# EAGLE schematic L6205_2XDC (EAGLE 9.3.1)
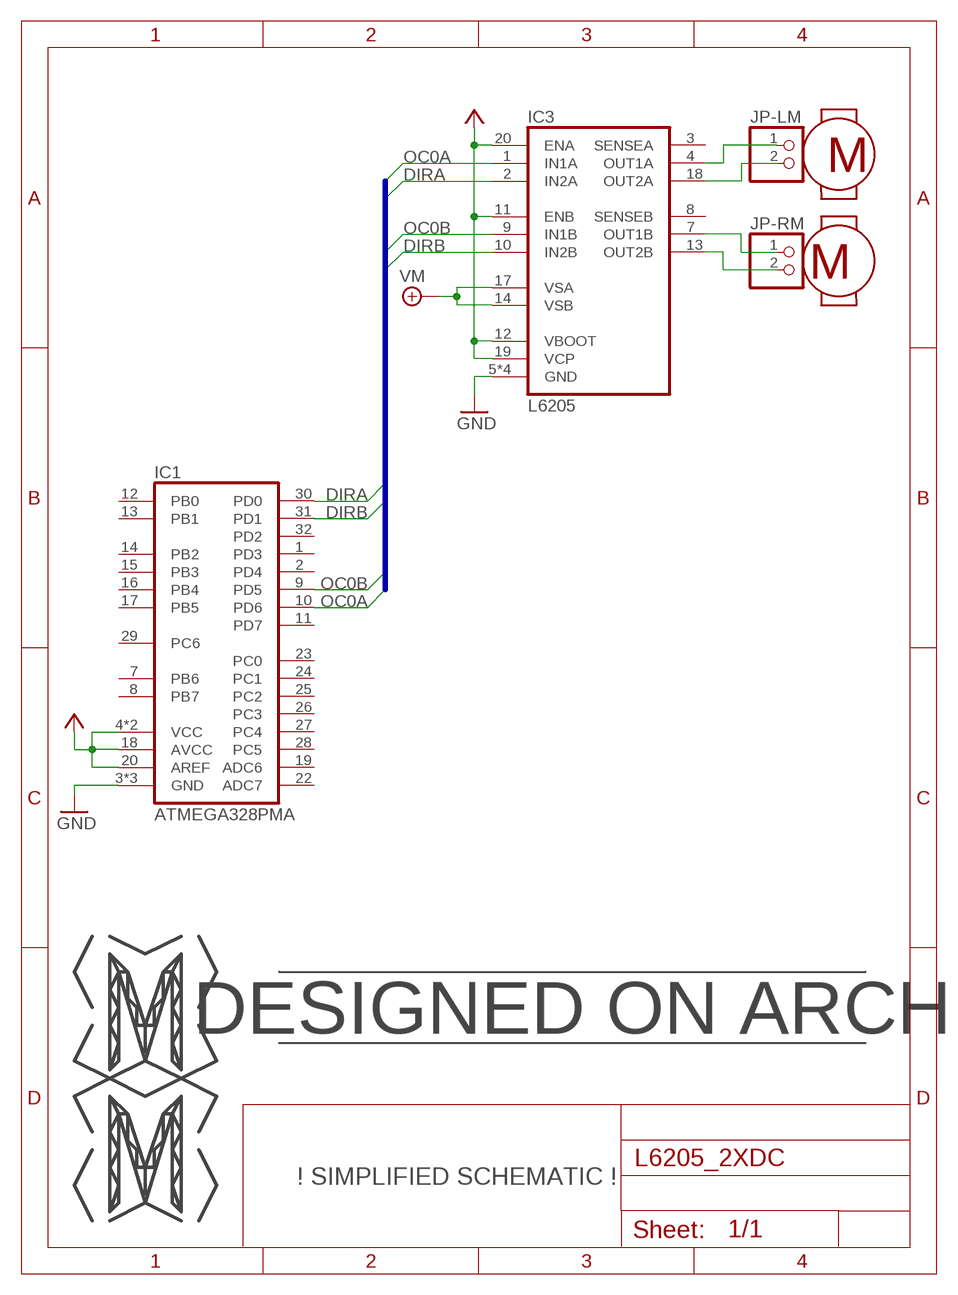
[diagram p0: schematic, sheet 1]

## Parts
IC1  ATMEGA328PMA  [TQFP32]
IC3  L6205  [SO20]
JP-LM  PINHD-1X2  [1X02]
JP-RM  PINHD-1X2  [1X02]

## Nets
DIRA: IC1.30(PD0) IC3.2(IN2A)
DIRB: IC1.31(PD1) IC3.10(IN2B)
GND: IC1.3(GND) IC1.5(GND) IC1.21(GND) IC3.5(GND) IC3.6(GND) IC3.15(GND) IC3.16(GND)
N$1: IC3.4(OUT1A) JP-LM.1
N$3: IC3.13(OUT2B) JP-RM.2
N$6: IC3.7(OUT1B) JP-RM.1
N$8: IC3.18(OUT2A) JP-LM.2
OC0A: IC1.10(PD6) IC3.1(IN1A)
OC0B: IC1.9(PD5) IC3.9(IN1B)
VCC: IC1.4(VCC) IC1.6(VCC) IC1.18(AVCC) IC1.20(AREF) IC3.11(ENB) IC3.12(VBOOT) IC3.19(VCP) IC3.20(ENA)
VM: IC3.14(VSB) IC3.17(VSA)
Unconnected: IC1.1(PD3) IC1.2(PD4) IC1.8(PB7) IC1.11(PD7) IC1.12(PB0) IC1.13(PB1) IC1.14(PB2) IC1.15(PB3) IC1.16(PB4) IC1.17(PB5) IC1.19(ADC6) IC1.22(ADC7) IC1.23(PC0) IC1.24(PC1) IC1.25(PC2) IC1.26(PC3) IC1.27(PC4) IC1.28(PC5) IC1.29(PC6) IC1.32(PD2) IC3.3(SENSEA) IC3.8(SENSEB)

## Buses
DIRA,DIRB,OC0A,OC0B

## Notes on the sheet
- DESIGNED ON ARCH
- ! SIMPLIFIED SCHEMATIC !

## Power pins joined to a net without a drawn wire
PB6: IC1.7(PB6)

## Library data of the parts
IC1 = martinmake:ATMEGA328P: 32A, 32-lead, 7 x 7 mm Body Size, 1.0 mm Body Thickness, 0.8 mm Lead Pitch, Thin Profile Plastic Quad Flat Package (TQFP)
IC3 = martinmake:L6205
JP-LM JP-RM = pinhead:PINHD-1X2: PIN HEADER